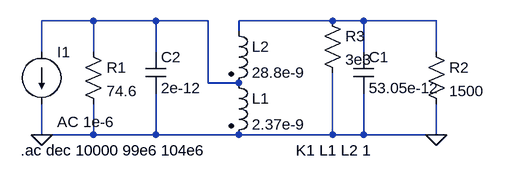
[diagram p0: schematic eje3.asc]
eje3.asc, the LTspice schematic file:
Version 4
SHEET 1 880 680
WIRE -160 96 -240 96
WIRE -64 96 -160 96
WIRE 16 96 -64 96
WIRE 208 96 64 96
WIRE 256 96 208 96
WIRE 368 96 256 96
WIRE 64 112 64 96
WIRE -240 144 -240 96
WIRE -160 144 -160 96
WIRE -64 144 -64 96
WIRE 256 144 256 96
WIRE 368 144 368 96
WIRE 16 192 16 96
WIRE 64 192 16 192
WIRE -240 272 -240 224
WIRE -160 272 -160 224
WIRE -160 272 -240 272
WIRE -64 272 -64 208
WIRE -64 272 -160 272
WIRE 64 272 -64 272
WIRE 208 272 208 176
WIRE 208 272 64 272
WIRE 256 272 256 208
WIRE 256 272 208 272
WIRE 368 272 368 224
WIRE 368 272 256 272
FLAG -240 272 0
FLAG 368 272 0
SYMBOL current -240 144 R0
WINDOW 123 24 108 Left 2
WINDOW 39 0 0 Left 2
SYMATTR Value2 AC 1e-6
SYMATTR InstName I1
SYMATTR Value ""
SYMBOL res -176 128 R0
SYMATTR InstName R1
SYMATTR Value 74.6
SYMBOL ind2 48 176 R0
SYMATTR InstName L1
SYMATTR Value 2.37e-9
SYMATTR Type ind
SYMATTR SpiceLine Rser=0
SYMBOL cap 240 144 R0
SYMATTR InstName C1
SYMATTR Value 53.05e-12
SYMBOL res 352 128 R0
SYMATTR InstName R2
SYMATTR Value 1500
SYMBOL cap -80 144 R0
SYMATTR InstName C2
SYMATTR Value 2e-12
SYMBOL ind2 48 96 R0
SYMATTR InstName L2
SYMATTR Value 28.8e-9
SYMATTR Type ind
SYMBOL res 192 80 R0
SYMATTR InstName R3
SYMATTR Value 3e3
TEXT -272 296 Left 2 !.ac dec 10000 99e6 104e6
TEXT 152 296 Left 2 !K1 L1 L2 1

The netlist it stands for:
* eje3.asc
I1 N001 0 AC 1e-6
R1 N001 0 74.6
L1 N001 0 2.37e-9 Rser=0
C1 N002 0 53.05e-12
R2 N002 0 1500
C2 N001 0 2e-12
L2 N002 N001 28.8e-9
R3 N002 0 3e3
.ac dec 10000 99e6 104e6
K1 L1 L2 1
.backanno
.end